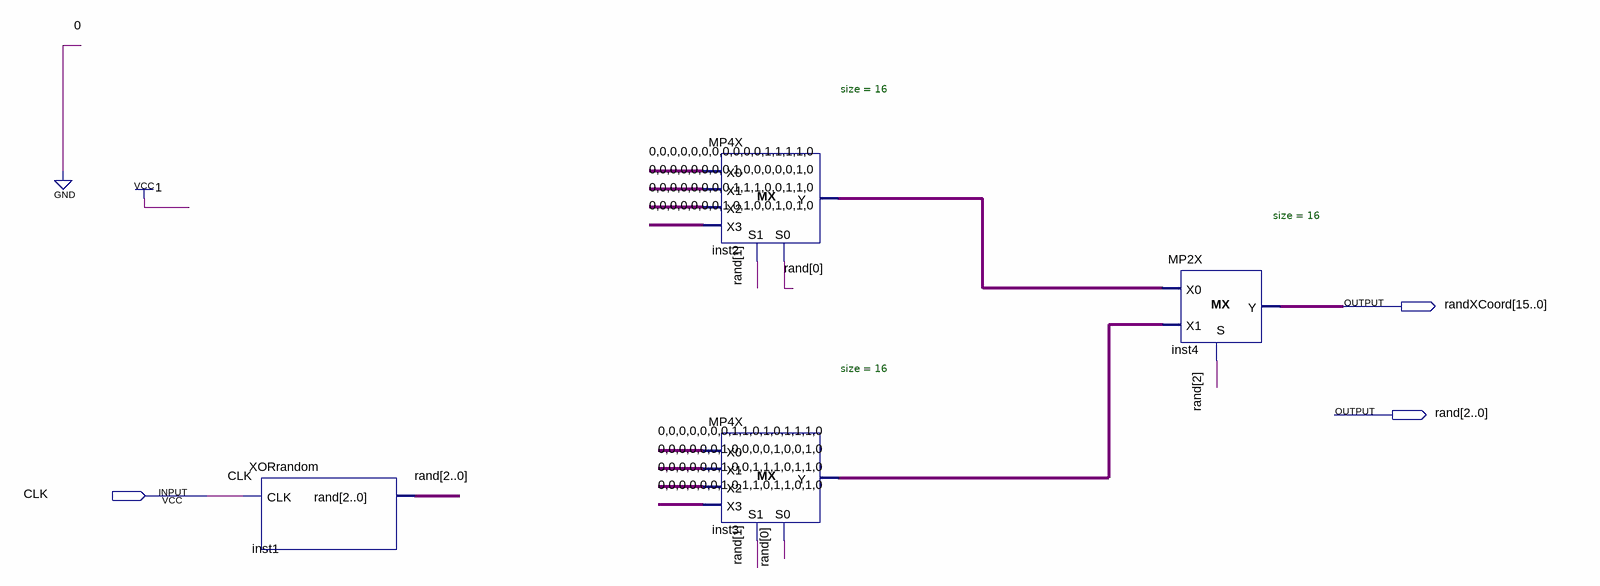
[diagram p0: schematic sheet]
// Quartus schematic xCoordGen.bdf as structural Verilog: 4 symbols, 3 pins
module xCoordGen (
  input  CLK,
  output [15:0] randXCoord,
  output [2:0] \rand 
);

  wire [15:0] inst2_y, inst3_y;

  XORrandom inst1 (.CLK(CLK), .\rand (\rand ));
  MP4X #(.size(16)) inst2 (
    .S0(\rand [0]), .S1(\rand [1]), .X0(16'b0000000000011110), .X1(16'b0000000010000010),
    .X2(16'b0000000011100110), .X3(16'b0000000101001010), .Y(inst2_y));
  MP4X #(.size(16)) inst3 (
    .S0(\rand [0]), .S1(\rand [1]), .X0(16'b0000000110101110), .X1(16'b0000001000010010),
    .X2(16'b0000001001110110), .X3(16'b0000001011011010), .Y(inst3_y));
  MP2X #(.size(16)) inst4 (.S(\rand [2]), .X0(inst2_y), .X1(inst3_y), .Y(randXCoord));
endmodule
